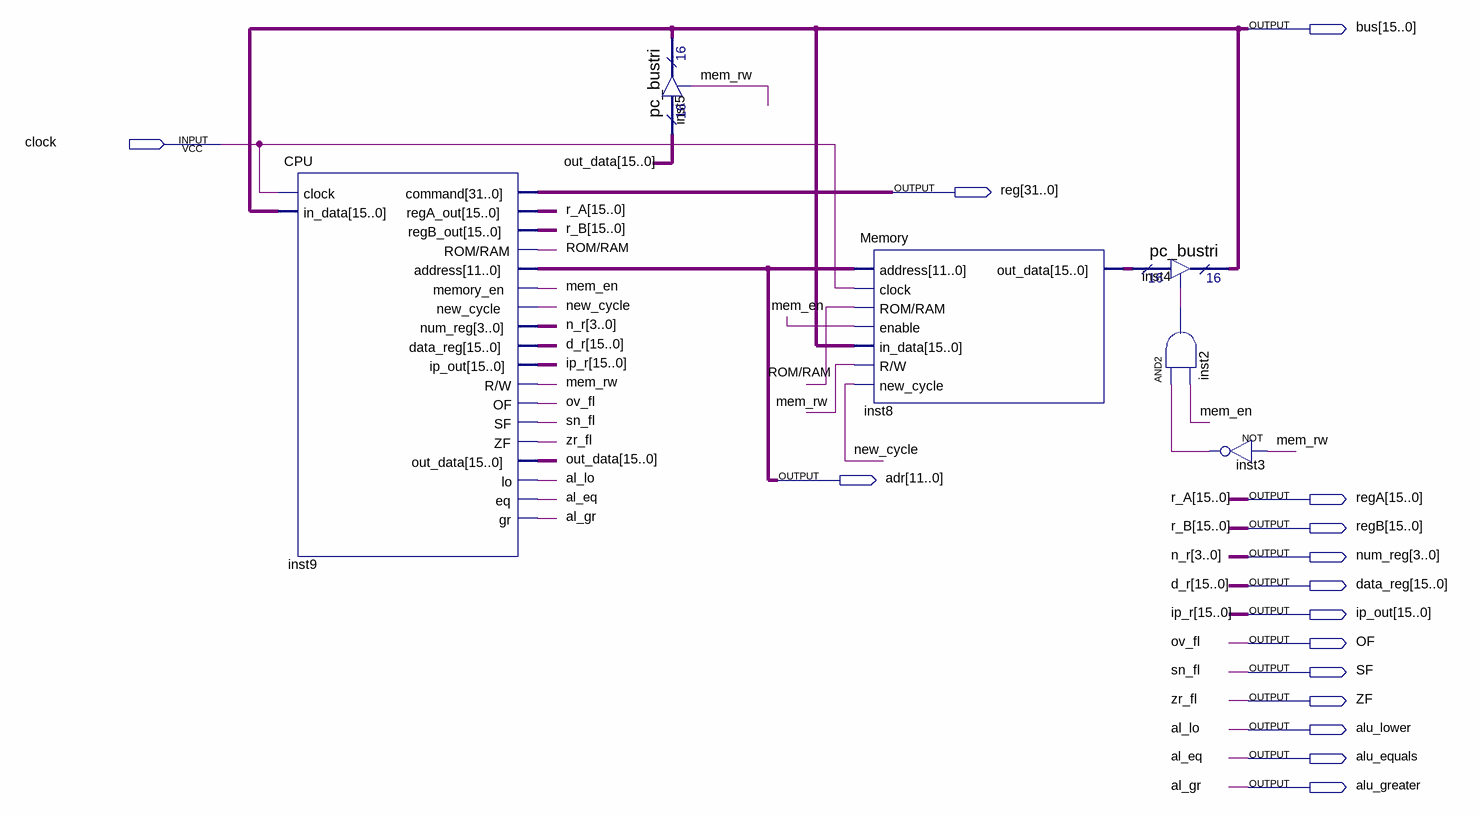
[diagram p0: schematic sheet]
// Quartus schematic Computer.bdf as structural Verilog: 6 symbols, 15 pins
module Computer (
  input  clock,
  output [15:0] bus,
  output [31:0] \reg ,
  output [11:0] adr,
  output [15:0] regA,
  output [15:0] regB,
  output [3:0] num_reg,
  output [15:0] data_reg,
  output [15:0] ip_out,
  output OF,
  output SF,
  output ZF,
  output alu_lower,
  output alu_equals,
  output alu_greater
);

  wire inst2_out, inst3_out, mem_en, mem_rw, new_cycle, \ROM/RAM ;
  wire [15:0] inst8_out_data, out_data;

  CPU inst9 (
    .clock(clock), .in_data(bus), .command(\reg ), .regA_out(regA), .regB_out(regB), .\ROM/RAM (\ROM/RAM ),
    .address(adr), .memory_en(mem_en), .new_cycle(new_cycle), .num_reg(num_reg), .data_reg(data_reg),
    .ip_out(ip_out), .\R/W (mem_rw), .OF(OF), .SF(SF), .ZF(ZF), .out_data(out_data), .lo(alu_lower),
    .eq(alu_equals), .gr(alu_greater));
  pc_bustri inst5 (.enabledt(mem_rw), .data(out_data), .tridata(bus));
  Memory inst8 (
    .address(adr), .clock(clock), .\ROM/RAM (\ROM/RAM ), .enable(mem_en), .in_data(bus), .\R/W (mem_rw),
    .new_cycle(new_cycle), .out_data(inst8_out_data));
  pc_bustri inst4 (.enabledt(inst2_out), .data(inst8_out_data), .tridata(bus));
  and inst2 (inst2_out, inst3_out, mem_en);
  not inst3 (inst3_out, mem_rw);

  // Other names for the same wires on the sheet: al_eq = alu_equals; al_gr = alu_greater; al_lo = alu_lower;
  //   d_r[15:0] = data_reg; ip_r[15:0] = ip_out; n_r[3:0] = num_reg; ov_fl = OF; r_A[15:0] = regA; r_B[15:0] = regB;
  //   sn_fl = SF; zr_fl = ZF
endmodule
